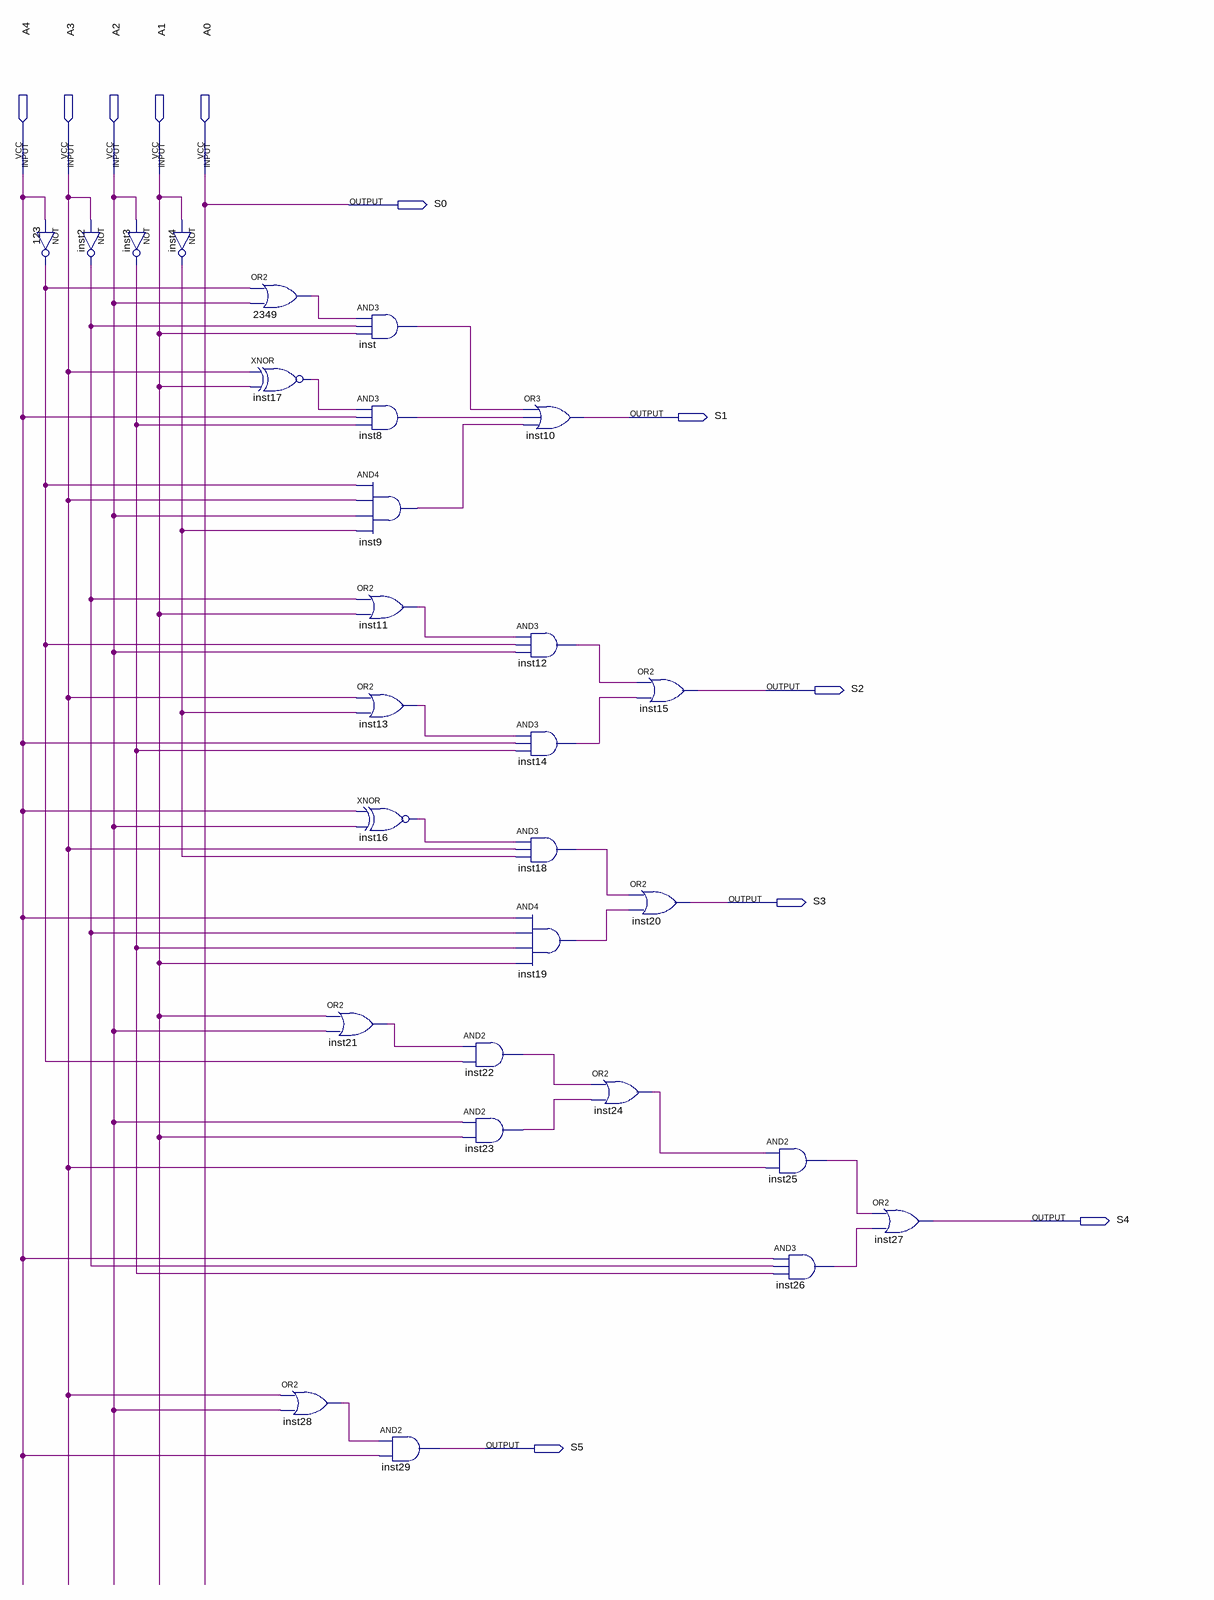
[diagram p0: schematic sheet]
// Quartus schematic Conversor.bdf as structural Verilog: 28 symbols, 11 pins
module Conversor (
  input  A4,
  input  A3,
  input  A2,
  input  A1,
  input  A0,
  output S0,
  output S1,
  output S2,
  output S3,
  output S4,
  output S5
);

  wire inst2_out, inst3_out, inst4_out, inst8_out, inst9_out, inst11_out, inst12_out, inst13_out, inst14_out,
       inst16_out, inst17_out, inst18_out, inst19_out, inst21_out, inst22_out, inst23_out, inst24_out,
       inst25_out, inst26_out, inst28_out, inst_out, n123_out, n2349_out;

  not inst2 (inst2_out, A3);
  not u_123 (n123_out, A4);
  not inst3 (inst3_out, A2);
  not inst4 (inst4_out, A1);
  or u_2349 (n2349_out, n123_out, A2);
  xnor inst17 (inst17_out, A3, A1);
  or inst21 (inst21_out, A1, A2);
  or inst28 (inst28_out, A3, A2);
  and inst (inst_out, n2349_out, inst2_out, A1);
  and inst8 (inst8_out, inst17_out, A4, inst3_out);
  and inst9 (inst9_out, n123_out, A3, A2, inst4_out);
  or inst11 (inst11_out, inst2_out, A1);
  or inst13 (inst13_out, A3, inst4_out);
  xnor inst16 (inst16_out, A4, A2);
  and inst29 (S5, inst28_out, A4);
  and inst22 (inst22_out, inst21_out, n123_out);
  and inst23 (inst23_out, A2, A1);
  or inst10 (S1, inst_out, inst8_out, inst9_out);
  and inst12 (inst12_out, inst11_out, n123_out, A2);
  and inst14 (inst14_out, inst13_out, A4, inst3_out);
  and inst18 (inst18_out, inst16_out, A3, inst4_out);
  and inst19 (inst19_out, A4, inst2_out, inst3_out, A1);
  or inst20 (S3, inst18_out, inst19_out);
  or inst24 (inst24_out, inst22_out, inst23_out);
  or inst15 (S2, inst12_out, inst14_out);
  and inst25 (inst25_out, inst24_out, A3);
  and inst26 (inst26_out, A4, inst2_out, inst3_out);
  or inst27 (S4, inst25_out, inst26_out);

  assign S0 = A0;
endmodule
